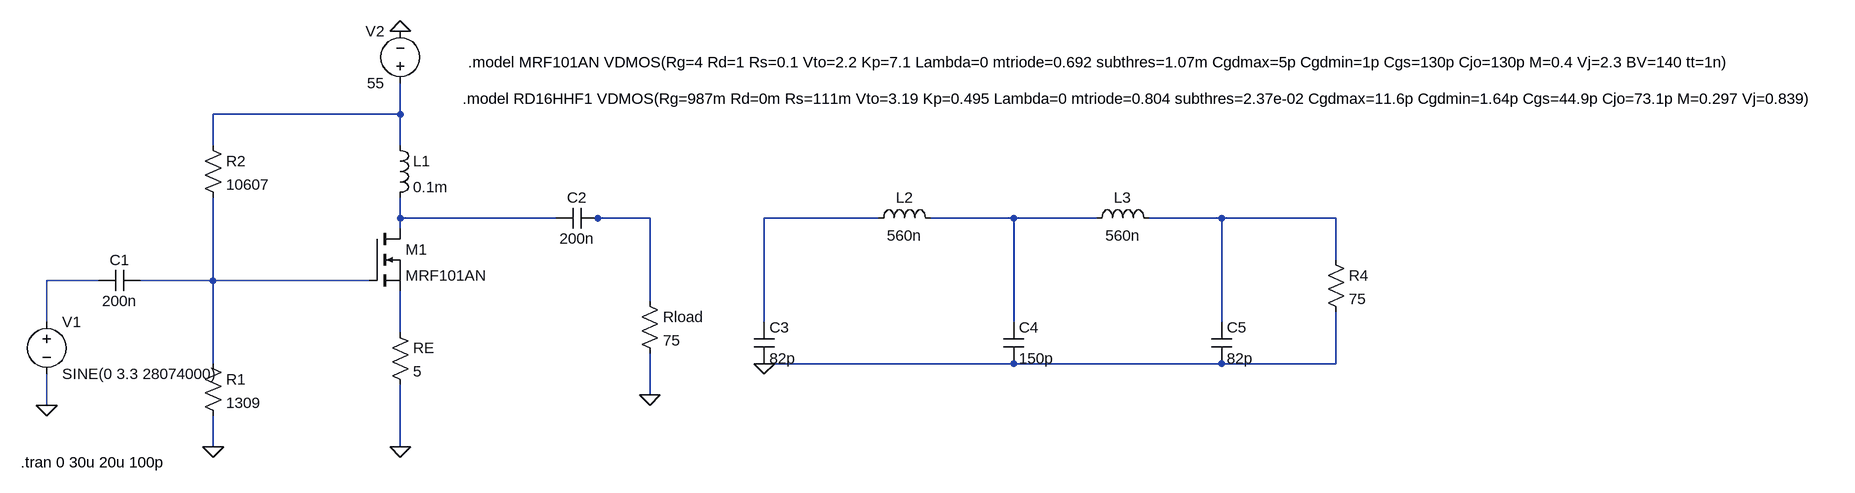
[diagram p0: schematic 10_meter_class_a.asc]
10_meter_class_a.asc, the LTspice schematic file:
Version 4
SHEET 1 3004 912
WIRE 624 -224 624 -272
WIRE 624 -224 336 -224
WIRE 336 -176 336 -224
WIRE 624 -176 624 -224
WIRE 624 -64 624 -96
WIRE 864 -64 624 -64
WIRE 928 -64 912 -64
WIRE 1008 -64 928 -64
WIRE 1360 -64 1184 -64
WIRE 1568 -64 1440 -64
WIRE 1696 -64 1568 -64
WIRE 1888 -64 1776 -64
WIRE 2064 -64 1888 -64
WIRE 624 -48 624 -64
WIRE 2064 0 2064 -64
WIRE 160 32 80 32
WIRE 336 32 336 -96
WIRE 336 32 224 32
WIRE 576 32 336 32
WIRE 1008 64 1008 -64
WIRE 80 96 80 32
WIRE 1184 96 1184 -64
WIRE 1568 96 1568 -64
WIRE 1888 96 1888 -64
WIRE 624 112 624 48
WIRE 336 160 336 32
WIRE 1568 160 1184 160
WIRE 1888 160 1568 160
WIRE 2064 160 2064 80
WIRE 2064 160 1888 160
WIRE 1008 208 1008 144
WIRE 80 224 80 176
WIRE 336 288 336 240
WIRE 624 288 624 192
FLAG 80 224 0
FLAG 336 288 0
FLAG 624 -352 0
FLAG 1008 208 0
FLAG 624 288 0
FLAG 1184 160 0
SYMBOL voltage 80 80 R0
WINDOW 123 0 0 Left 0
WINDOW 39 0 0 Left 0
SYMATTR InstName V1
SYMATTR Value SINE(0 3.3 28074000)
SYMBOL cap 224 16 R90
WINDOW 0 0 32 VBottom 2
WINDOW 3 32 32 VTop 2
SYMATTR InstName C1
SYMATTR Value 200n
SYMBOL res 320 144 R0
SYMATTR InstName R1
SYMATTR Value 1309
SYMBOL res 320 -192 R0
SYMATTR InstName R2
SYMATTR Value 10607
SYMBOL ind 608 -192 R0
SYMATTR InstName L1
SYMATTR Value 0.1m
SYMBOL voltage 624 -256 R180
WINDOW 0 24 96 Left 2
WINDOW 3 24 16 Left 2
WINDOW 123 0 0 Left 0
WINDOW 39 0 0 Left 0
SYMATTR InstName V2
SYMATTR Value 55
SYMBOL cap 928 -80 R90
WINDOW 0 0 32 VBottom 2
WINDOW 3 32 32 VTop 2
SYMATTR InstName C2
SYMATTR Value 200n
SYMBOL res 992 48 R0
SYMATTR InstName Rload
SYMATTR Value 75
SYMBOL res 608 96 R0
SYMATTR InstName RE
SYMATTR Value 5
SYMBOL nmos 576 -48 R0
SYMATTR InstName M1
SYMATTR Value MRF101AN
SYMBOL cap 1168 96 R0
SYMATTR InstName C3
SYMATTR Value 82p
SYMBOL ind 1344 -48 R270
WINDOW 0 32 56 VTop 2
WINDOW 3 5 56 VBottom 2
SYMATTR InstName L2
SYMATTR Value 560n
SYMBOL cap 1552 96 R0
SYMATTR InstName C4
SYMATTR Value 150p
SYMBOL cap 1872 96 R0
SYMATTR InstName C5
SYMATTR Value 82p
SYMBOL ind 1680 -48 R270
WINDOW 0 32 56 VTop 2
WINDOW 3 5 56 VBottom 2
SYMATTR InstName L3
SYMATTR Value 560n
SYMBOL res 2048 -16 R0
SYMATTR InstName R4
SYMATTR Value 75
TEXT 40 312 Left 2 !.tran 0 30u 20u 100p
TEXT 720 -248 Left 2 !.model RD16HHF1 VDMOS(Rg=987m Rd=0m Rs=111m Vto=3.19 Kp=0.495 Lambda=0 mtriode=0.804 subthres=2.37e-02 Cgdmax=11.6p Cgdmin=1.64p Cgs=44.9p Cjo=73.1p M=0.297 Vj=0.839)
TEXT 728 -304 Left 2 !.model MRF101AN VDMOS(Rg=4 Rd=1 Rs=0.1 Vto=2.2 Kp=7.1 Lambda=0 mtriode=0.692 subthres=1.07m Cgdmax=5p Cgdmin=1p Cgs=130p Cjo=130p M=0.4 Vj=2.3 BV=140 tt=1n)

The netlist it stands for:
* 10_meter_class_a.asc
V1 N007 0 SINE(0 3.3 28074000)
C1 N008 N007 200n
R1 N008 0 1309
R2 N001 N008 10607
L1 N001 N002 0.1m
V2 N001 0 55
C2 N003 N002 200n
Rload N003 0 75
RE N009 0 5
M1 N002 N008 N009 N009 MRF101AN
C3 N004 0 82p
L2 N004 N005 560n
C4 N005 0 150p
C5 N006 0 82p
L3 N005 N006 560n
R4 N006 0 75
.model NMOS NMOS
.model PMOS PMOS
.lib standard.mos
.tran 0 30u 20u 100p
.model RD16HHF1 VDMOS(Rg=987m Rd=0m Rs=111m Vto=3.19 Kp=0.495 Lambda=0 mtriode=0.804 subthres=2.37e-02 Cgdmax=11.6p Cgdmin=1.64p Cgs=44.9p Cjo=73.1p M=0.297 Vj=0.839)
.model MRF101AN VDMOS(Rg=4 Rd=1 Rs=0.1 Vto=2.2 Kp=7.1 Lambda=0 mtriode=0.692 subthres=1.07m Cgdmax=5p Cgdmin=1p Cgs=130p Cjo=130p M=0.4 Vj=2.3 BV=140 tt=1n)
.backanno
.end